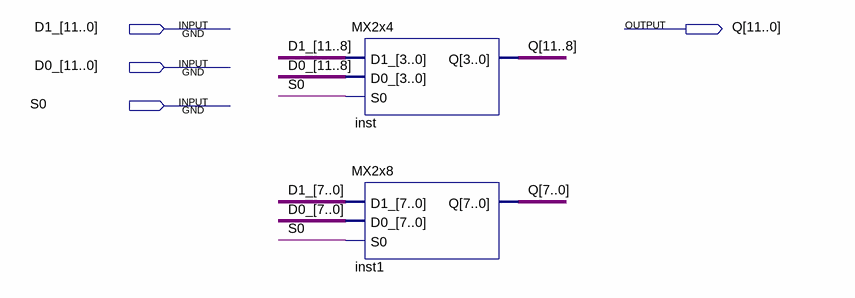
[diagram p0: schematic sheet]
// Quartus schematic MX2x12.bdf as structural Verilog: 2 symbols, 4 pins
module MX2x12 (
  input  [11:0] D1_,
  input  [11:0] D0_,
  input  S0,
  output [11:0] Q
);

  MX2x4 inst (.D1_(D1_[11:8]), .D0_(D0_[11:8]), .S0(S0), .Q(Q[11:8]));
  MX2x8 inst1 (.D1_(D1_[7:0]), .D0_(D0_[7:0]), .S0(S0), .Q(Q[7:0]));
endmodule
